# EAGLE design Display_Block (EAGLE 5.06)
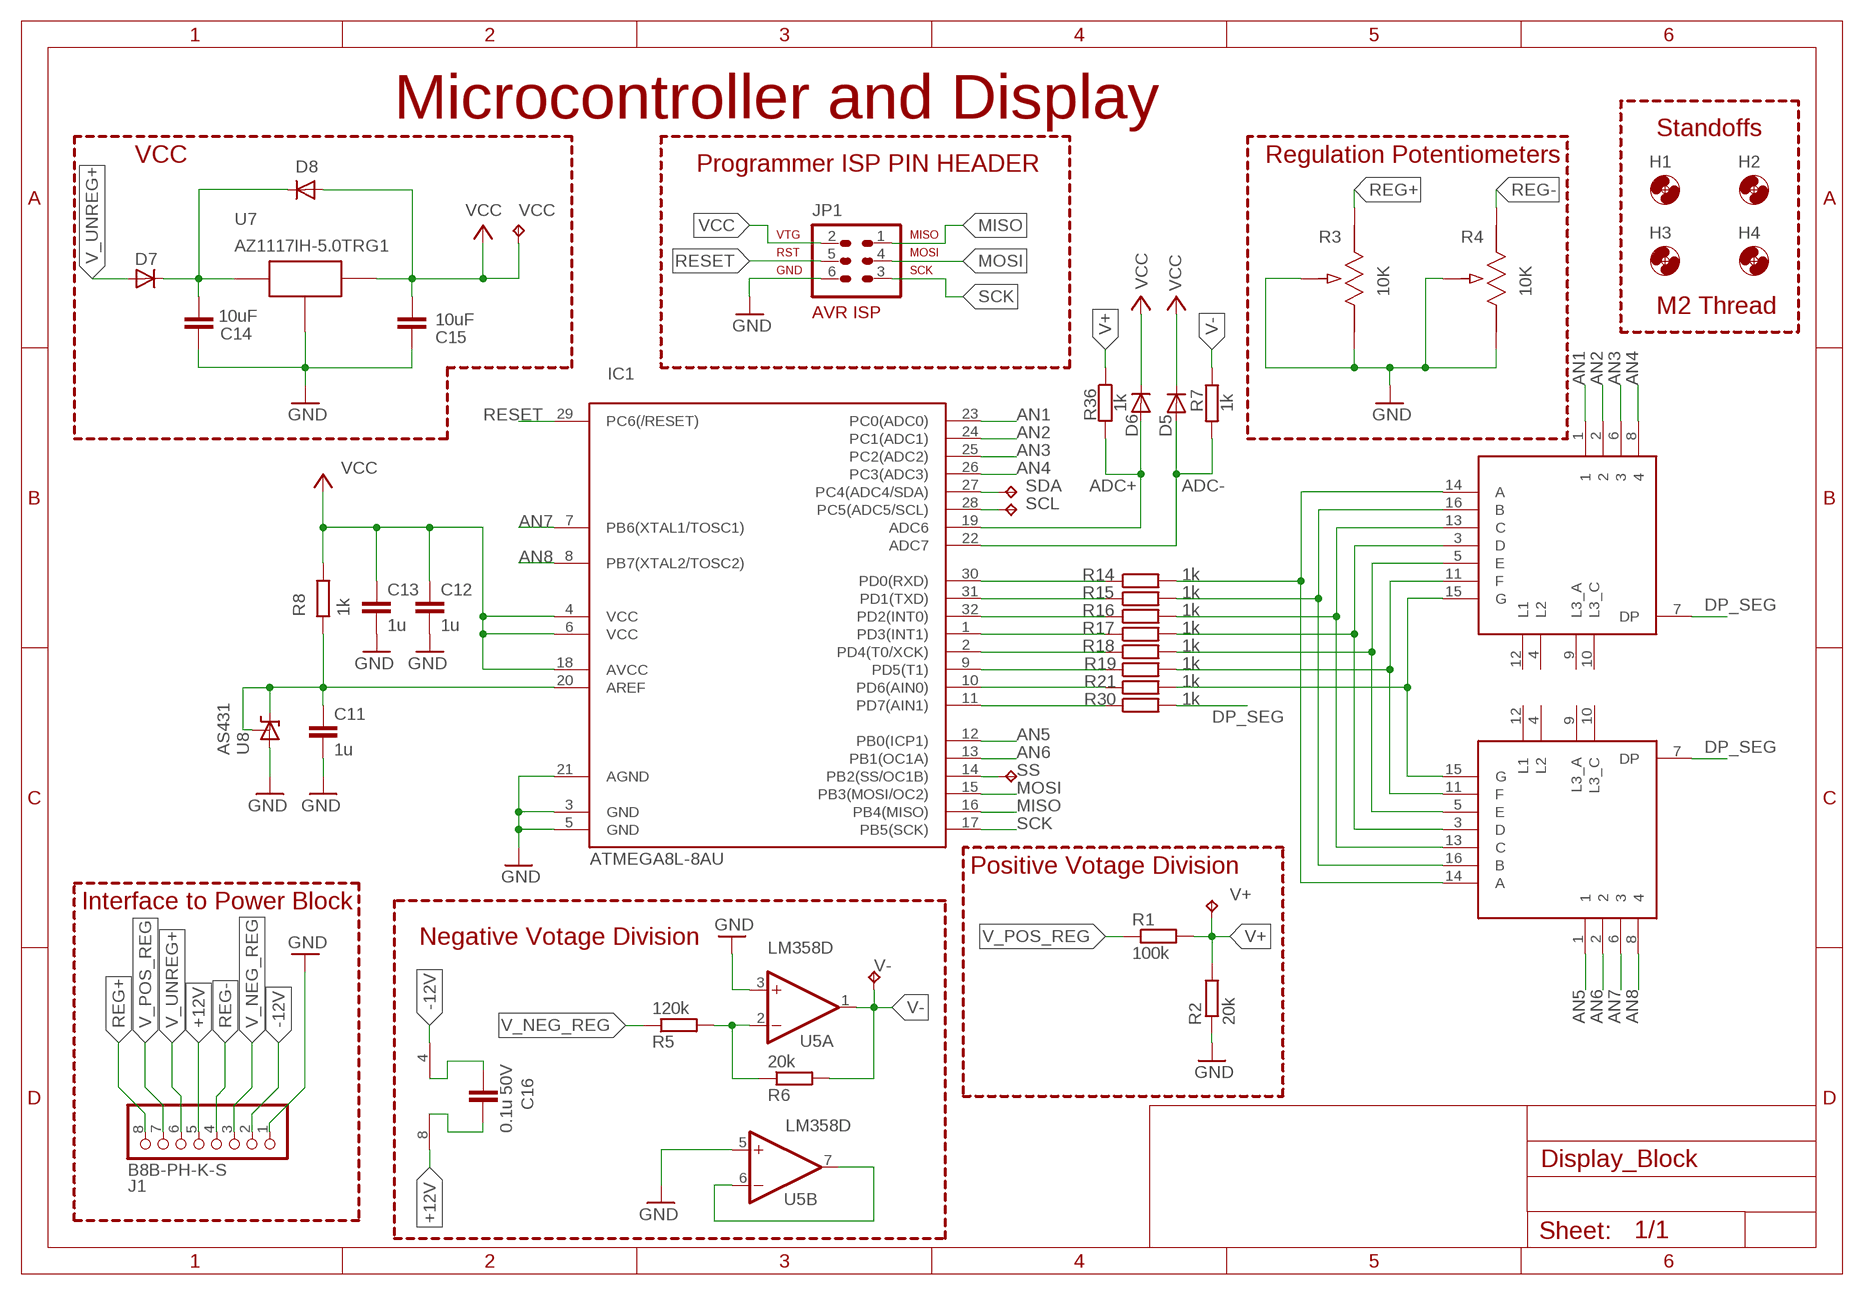
[diagram p0: schematic, sheet 1]

## Parts
C11  1u  C-EUC0603  [C0603]
C12  1u  C-EUC0603  [C0603]
C13  1u  C-EUC0603  [C0603]
C14  10uF  C-EUC0603  [C0603]
C15  10uF  C-EUC0603  [C0603]
C16  0.1u 50V  C-EU025-024X044  [C025-024X044]
D5  1N4148DO35-7  [DO35-7]
D6  1N4148DO35-7  [DO35-7]
D7  1N4004  [DO41-10]
D8  1N4004  [DO41-10]
H1  MOUNT-PAD-ROUND2.2  MOUNT-HOLE2.2  [2,2]
H2  MOUNT-PAD-ROUND2.2  MOUNT-HOLE2.2  [2,2]
H3  MOUNT-PAD-ROUND2.2  MOUNT-HOLE2.2  [2,2]
H4  MOUNT-PAD-ROUND2.2  MOUNT-HOLE2.2  [2,2]
IC1  ATMEGA8L-8AU  ATMEGA8-AU  [TQFP32-08]
J1  B8B-PH-K-S  [B8B-PH-K-S]
JP1  AVR-ISP-6  [AVR-ISP-6]
R1  100k  R-EU_R0603  [R0603]
R2  20k  R-EU_R0603  [R0603]
R3  10K  P120PK-Y25BR10K  [POT_P120PK-X25_TTE]
R4  10K  P120PK-Y25BR10K  [POT_P120PK-X25_TTE]
R5  120k  R-EU_R0603  [R0603]
R6  20k  R-EU_R0603  [R0603]
R7  1k  R-EU_R0603  [R0603]
R8  1k  R-EU_R0603  [R0603]
R14  1k  R-EU_R0603  [R0603]
R15  1k  R-EU_R0603  [R0603]
R16  1k  R-EU_R0603  [R0603]
R17  1k  R-EU_R0603  [R0603]
R18  1k  R-EU_R0603  [R0603]
R19  1k  R-EU_R0603  [R0603]
R21  1k  R-EU_R0603  [R0603]
R30  1k  R-EU_R0603  [R0603]
R36  1k  R-EU_R0603  [R0603]
SCL  TPTP20SQ  [TP20SQ]
SDA  TPTP20SQ  [TP20SQ]
SEG1  TDCG1050M-ND  [TDCX10X0M]
SEG2  TDCR1050M-ND  [TDCX10X0M]
SS  TPTP20SQ  [TP20SQ]
U5  LM358D  [SO08]
U7  AZ1117IH-5.0TRG1  [SOT223]
U8  AS431  AS431ANTR-G1  [SOT23]
V+  TPTP20SQ  [TP20SQ]
V-  TPTP20SQ  [TP20SQ]
VCC  TPTP20SQ  [TP20SQ]

## Nets
+12V: C16.2 J1.5 U5.8(P:V+)
-12V: C16.1 J1.2 U5.4(P:V-)
ADC+: D6.A IC1.19(ADC6) R36.2
ADC-: D5.A IC1.22(ADC7) R7.2
AN1: IC1.23(PC0(ADC0)) SEG1.1
AN2: IC1.24(PC1(ADC1)) SEG1.2
AN3: IC1.25(PC2(ADC2)) SEG1.6
AN4: IC1.26(PC3(ADC3)) SEG1.8
AN5: IC1.12(PB0(ICP1)) SEG2.1
AN6: IC1.13(PB1(OC1A)) SEG2.2
AN7: IC1.7(PB6(XTAL1/TOSC1)) SEG2.6
AN8: IC1.8(PB7(XTAL2/TOSC2)) SEG2.8
AREF: C11.1 IC1.20(AREF) R8.1 U8.1(REF) U8.2(C)
DP_SEG: R30.2 SEG1.7(DP) SEG2.7(DP)
GND: C11.2 C12.2 C13.2 C14.1 C15.1 IC1.3(GND) IC1.5(GND) IC1.21(AGND) J1.1 JP1.6 R2.1 R3.1 R3.2 R4.1 R4.2 U5.3(A:+IN) U5.5(B:+IN) U7.2 U8.3(A)
MISO: IC1.16(PB4(MISO)) JP1.1
MOSI: IC1.15(PB3(MOSI/OC2)) JP1.4
N$5: U5.6(B:-IN) U5.7(B:OUT)
N$16: R5.2 R6.1 U5.2(A:-IN)
N$19: C14.2 D7.C D8.C U7.1
PD0: IC1.30(PD0(RXD)) R14.1
PD1: IC1.31(PD1(TXD)) R15.1
PD2: IC1.32(PD2(INT0)) R16.1
PD3: IC1.1(PD3(INT1)) R17.1
PD4: IC1.2(PD4(T0/XCK)) R18.1
PD5: IC1.9(PD5(T1)) R19.1
PD6: IC1.10(PD6(AIN0)) R21.1
PD7: IC1.11(PD7(AIN1)) R30.1
REG+: J1.8 R3.3
REG-: J1.4 R4.3
RESET: IC1.29(PC6(/RESET)) JP1.5
SCK: IC1.17(PB5(SCK)) JP1.3
SCL: IC1.28(PC5(ADC5/SCL)) SCL.TP
SDA: IC1.27(PC4(ADC4/SDA)) SDA.TP
SEG_A: R14.2 SEG1.14(A) SEG2.14(A)
SEG_B: R15.2 SEG1.16(B) SEG2.16(B)
SEG_C: R16.2 SEG1.13(C) SEG2.13(C)
SEG_D: R17.2 SEG1.3(D) SEG2.3(D)
SEG_E: R18.2 SEG1.5(E) SEG2.5(E)
SEG_F: R19.2 SEG1.11(F) SEG2.11(F)
SEG_G: R21.2 SEG1.15(G) SEG2.15(G)
SS: IC1.14(PB2(SS/OC1B)) SS.TP
V+: R1.2 R2.2 R36.1 V+.TP
V-: R6.2 R7.1 U5.1(A:OUT) V-.TP
V_NEG_REG: J1.3 R5.1
V_POS_REG: J1.7 R1.1
V_UNREG+: D7.A J1.6
VCC: C12.1 C13.1 C15.2 D5.C D6.C D8.A IC1.4(VCC) IC1.6(VCC) IC1.18(AVCC) JP1.2 R8.2 U7.3 VCC.TP
Unconnected: SEG1.4(L2) SEG1.9(L3_A) SEG1.10(L3_C) SEG1.12(L1) SEG2.4(L2) SEG2.9(L3_A) SEG2.10(L3_C) SEG2.12(L1)

## Notes on the sheet
- Microcontroller and Display
- Standoffs
- VCC | Regulation Potentiometers
- Programmer ISP PIN HEADER
- M2 Thread
- Positive Votage Division
- Interface to Power Block
- Negative Votage Division

## Library data of the parts
C11-C16 = rcl:C-EU: CAPACITOR, European symbol
D5 D6 = diode:1N4148: DIODE high speed (Philips)
D7 D8 = diode:1N4004: DIODE general purpose rectifier, 1 A
H1-H4 = holes:MOUNT-HOLE: MOUNTING HOLE with drill center marker
IC1 = atmega8:ATMEGA8
J1 = VladimirG:B8B-PH-K-S: CONN HEADER VERT 8POS 2MM
JP1 = avr-4:AVR-ISP-6: AVR ISP-6 Serial Programming Header
R1 R2 R5 R6 R8 = rcl:R-EU_: RESISTOR, European symbol
R3 R4 = VladimirG:P120PK-Y25BR10K: POT 10K OHM 1/20W PLASTIC LINEAR; COPYRIGHT: Copyright (C) 2025 Ultra Librarian. All rights reserved.; MANUFACTURER_NAME: TT Electronics; MANUFACTURER_PART_NUMBER: P120PK-Y25BR10K; VALUE: 10k
R7 R14-R19 R21 R30 R36 = resistor:R-EU_: RESISTOR, European symbol
SCL SDA SS V+ V- VCC = testpad:TP: Test pad
SEG1 = VladimirG:TDCG1050M-ND
SEG2 = VladimirG:TDCR1050M-ND
U5 = linear:LM358: OP AMP also LM158; LM258; LM2904 Source: http://cache.national.com/ds/LM/LM158.pdf
U7 = VladimirG:AZ1117IH-5.0TRG1: Linear Voltage Regulator IC Positive Fixed 1 Output 1A SOT-223-3
U8 = VladimirG:AS431ANTR-G1: Shunt Voltage Reference IC Adjustable 2.5V 36 VV ±0.5% 100 mA SOT-23-3

## Board
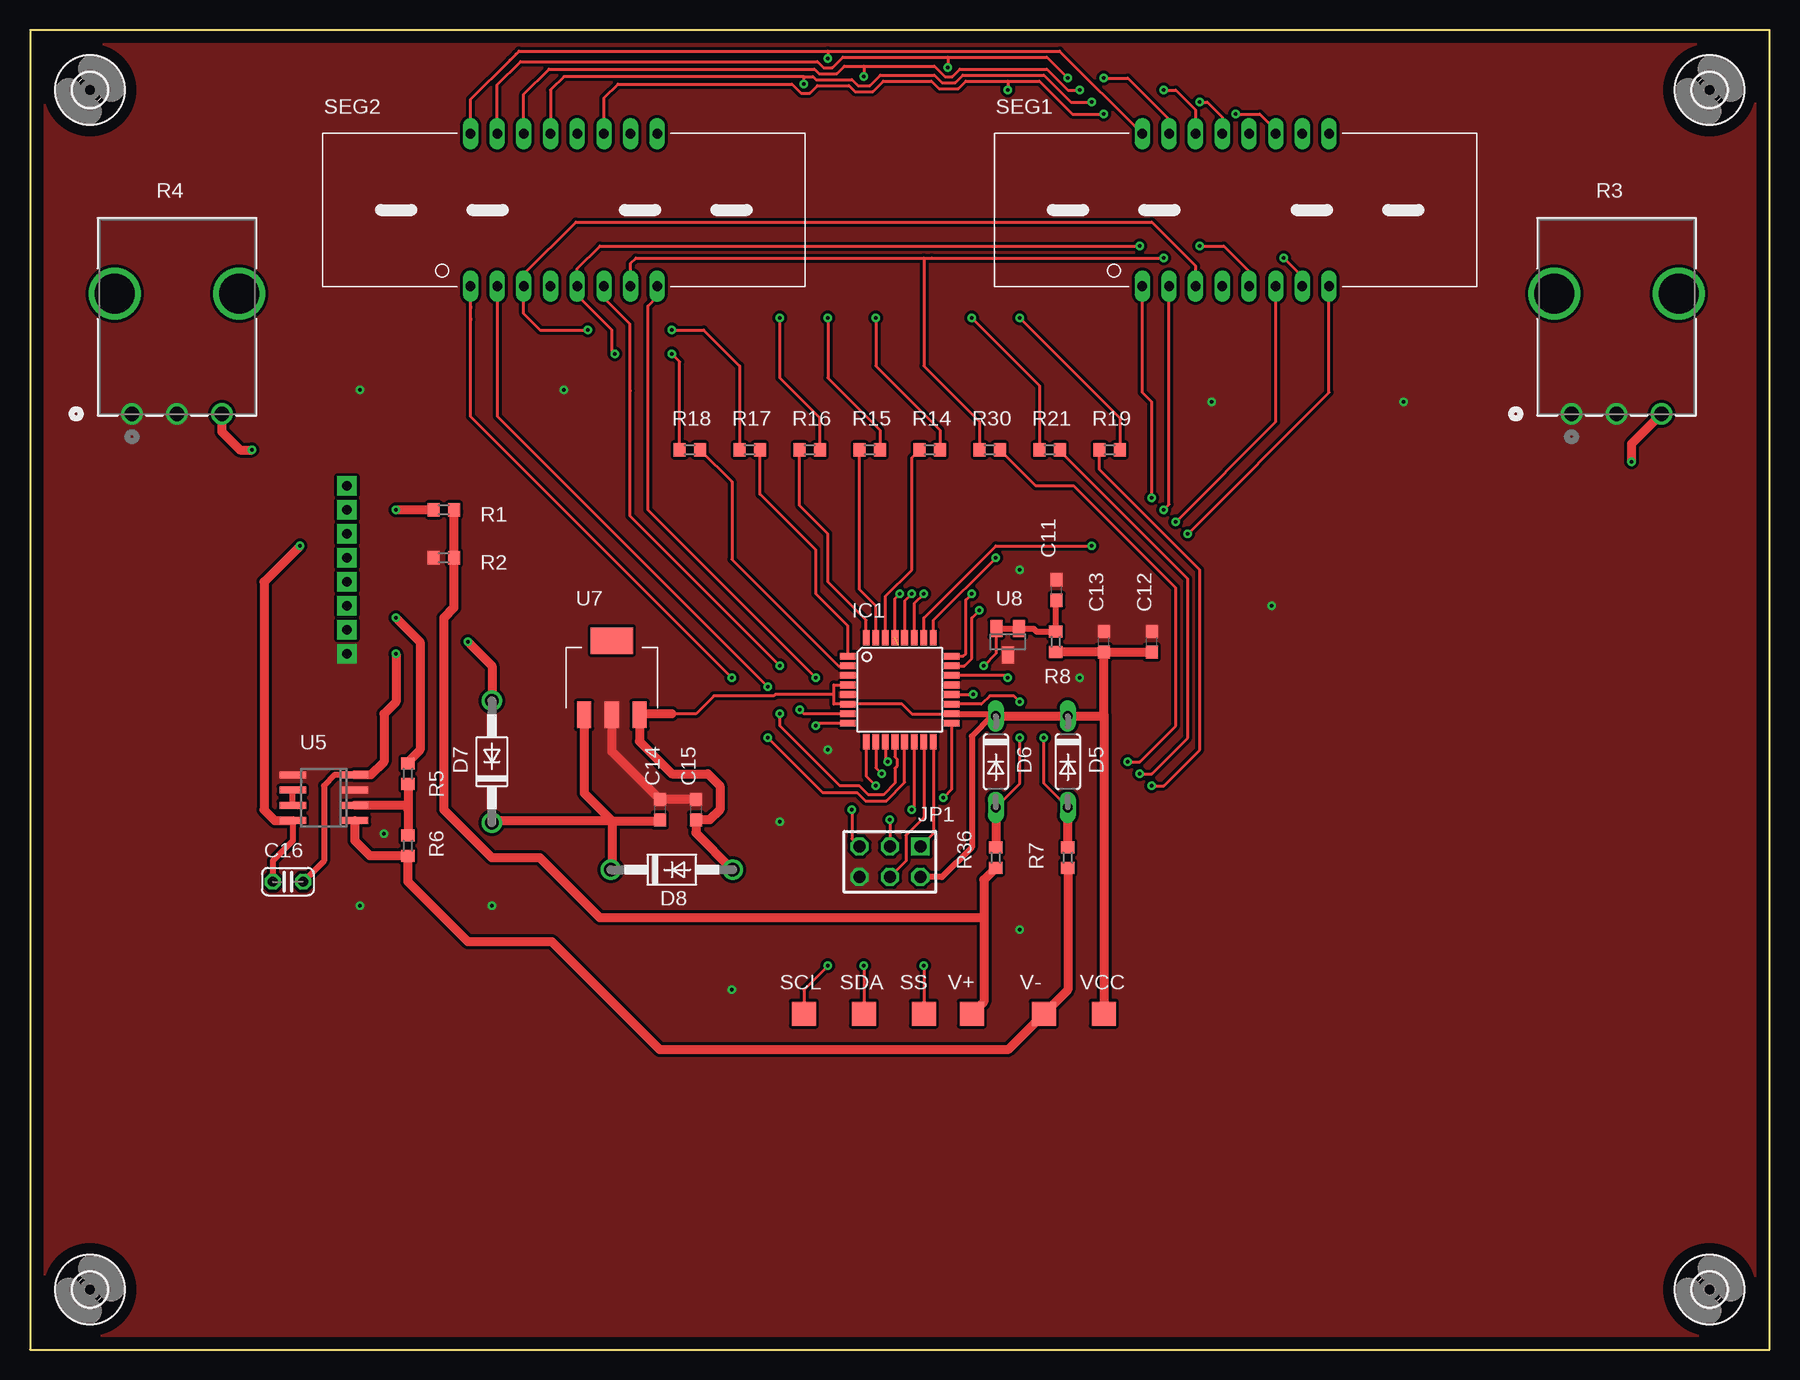
[diagram p1: board, top side]
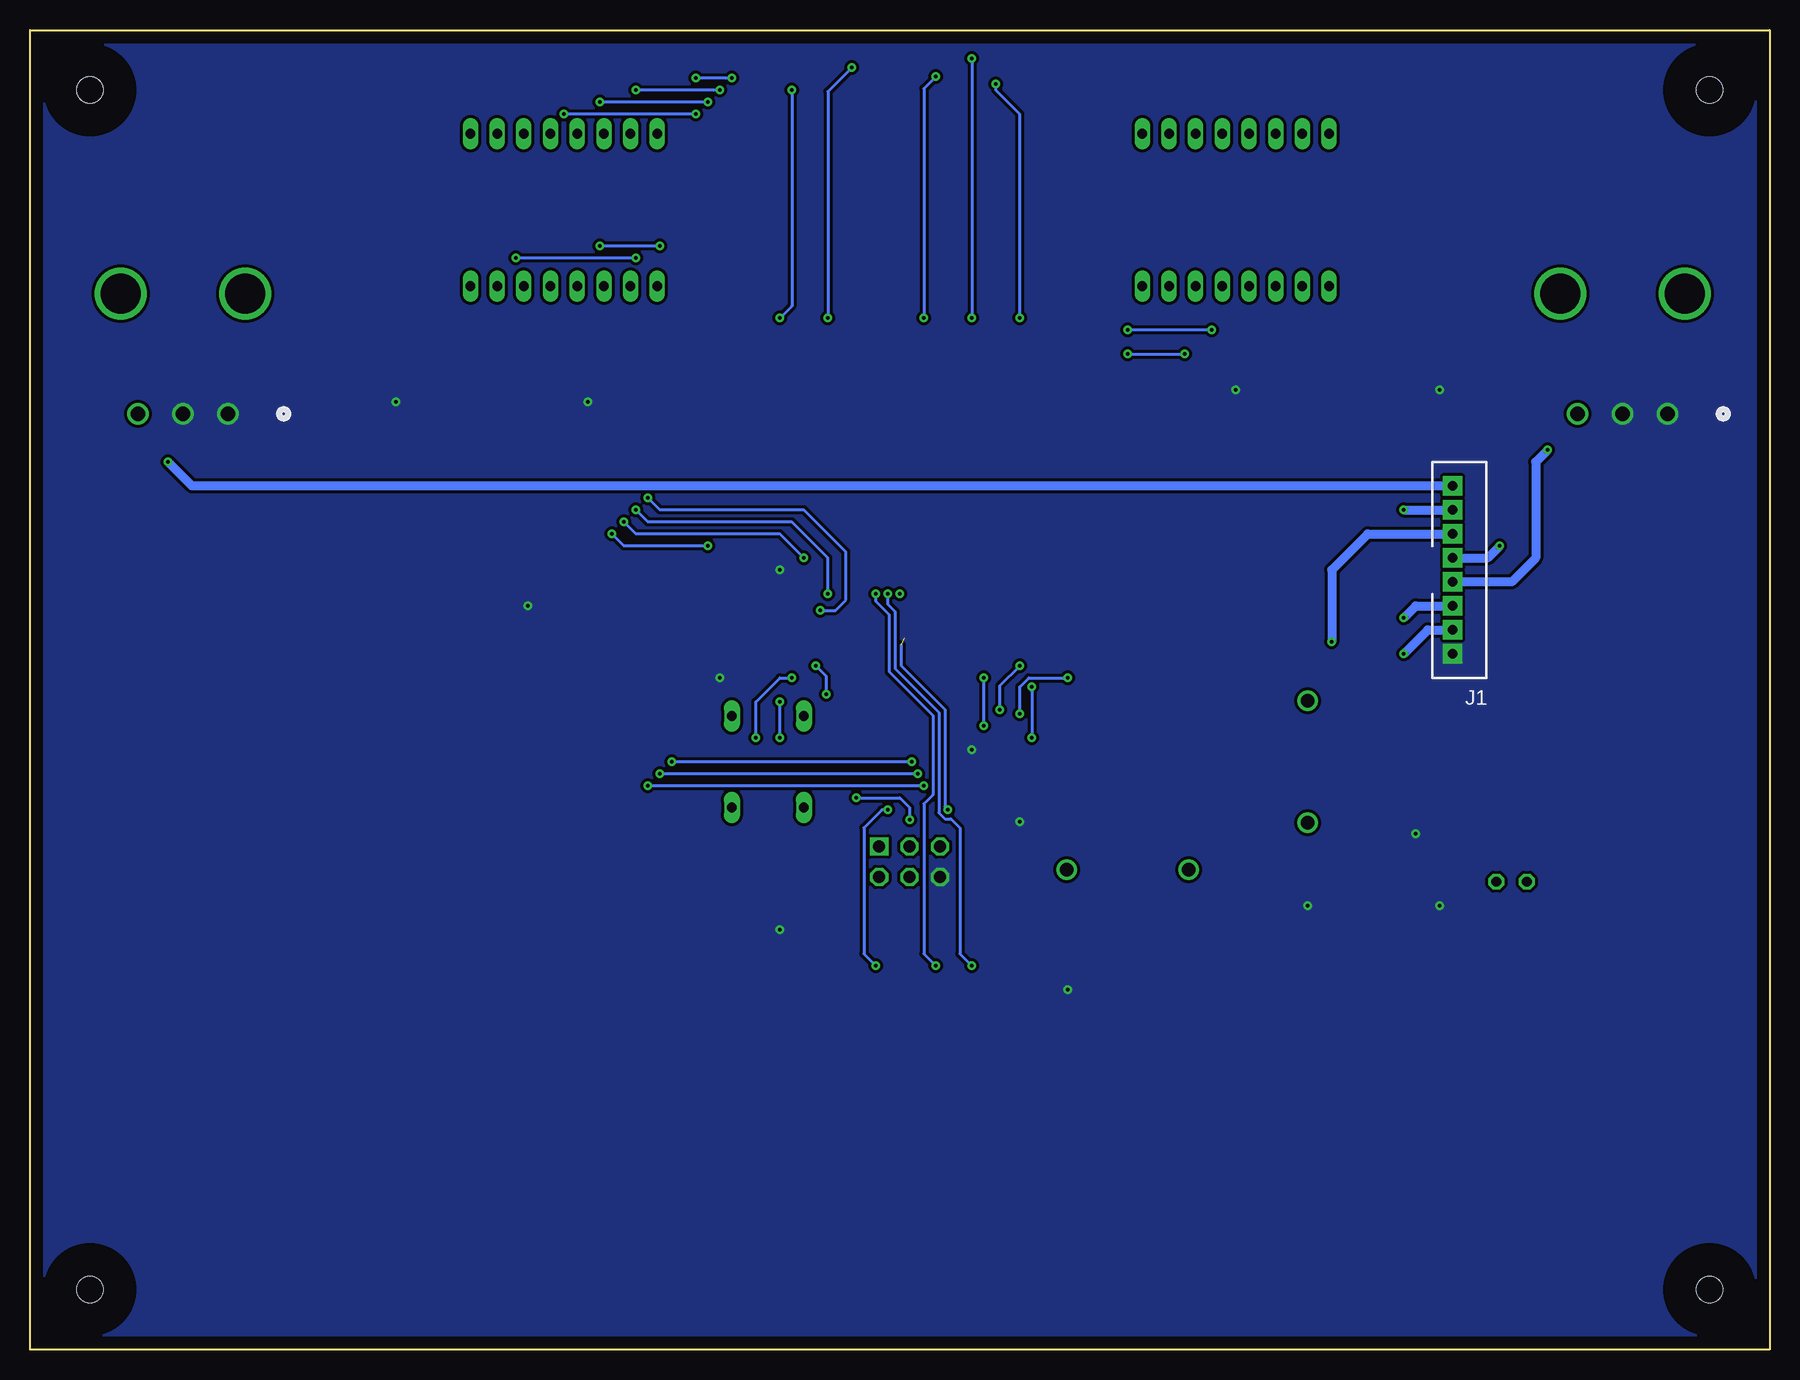
[diagram p2: board, bottom side, seen from below]

Size 145 x 110 mm. Coordinates in mm from the lower left corner, seen from the top.
Outline: 0,0 145,0 145,110 0,110 0,0
Copper layers (1*16): Top 0.035mm / dielectric 1.5mm / Bottom 0.035mm
Design rules "default *": minimum track width 8mil, minimum drill 12mil, track to track 8mil, track to pad 8mil, pad to pad 8mil, via to via 8mil, smd to smd 8mil, copper to edge 40mil, drill to drill 8mil, minimum pad ring 10mil, minimum via ring 8mil, stop-mask expansion 4mil, vias tented up to drill 999mil, thermal gap 10mil

### Footprints (pad centres in the part's own frame; a part is rotated, then mirrored left to right if it is on the bottom)
C0603 = smd 1.1 x 1: 1 -0.85,0; 2 0.85,0
C025-024X044 = drill 0.813 octagon: 1 -1.27,0; 2 1.27,0
DO35-7 = drill 0.813 long: A 3.81,0; C -3.81,0
DO41-10 = drill 1.118 round: A 5.08,0; C -5.08,0
2,2 = hole 2.2: 0,0
TQFP32-08 = smd 1.27 x 0.559: 1 -4.325,2.8; 2 -4.325,2; 3 -4.325,1.2; 4 -4.325,0.4; 5 -4.325,-0.4; 6 -4.325,-1.2; 7 -4.325,-2; 8 -4.325,-2.8; 17 4.325,-2.8; 18 4.325,-2; 19 4.325,-1.2; 20 4.325,-0.4; 21 4.325,0.4; 22 4.325,1.2; 23 4.325,2; 24 4.325,2.8 | smd 0.559 x 1.27: 9 -2.8,-4.325; 10 -2,-4.325; 11 -1.2,-4.325; 12 -0.4,-4.325; 13 0.4,-4.325; 14 1.2,-4.325; 15 2,-4.325; 16 2.8,-4.325; 25 2.8,4.325; 26 2,4.325; 27 1.2,4.325; 28 0.4,4.325; 29 -0.4,4.325; 30 -1.2,4.325; 31 -2,4.325; 32 -2.8,4.325
B8B-PH-K-S = drill 0.8 pad 1.6 square: 1 -0.085,7; 2 -0.085,5; 3 -0.085,3; 4 -0.085,1; 5 -0.085,-1; 6 -0.085,-3; 7 -0.085,-5; 8 -0.085,-7
AVR-ISP-6 = drill 1.016 square: 1 -2.54,-1.27 | drill 1.016 octagon: 2 -2.54,1.27; 3 0,-1.27; 4 0,1.27; 5 2.54,-1.27; 6 2.54,1.27
R0603 = smd 1 x 1.1: 1 -0.85,0; 2 0.85,0
POT_P120PK-X25_TTE = drill 1.194 pad 1.702 round: 1 0,0; 2 3.759,0; 3 7.493,0 | drill 3.327 pad 3.327 round: 4 -1.448,10.008; 5 8.941,10.008
TP20SQ = smd 2 x 2: TP 0,0
TDCX10X0M = drill 0.8 long: 1 -7.779,-6.35; 2 -5.556,-6.35; 3 -3.334,-6.35; 4 -1.111,-6.35; 5 1.111,-6.35; 6 3.334,-6.35; 7 5.556,-6.35; 8 7.779,-6.35; 9 7.779,6.35; 10 5.556,6.35; 11 3.334,6.35; 12 1.111,6.35; 13 -1.111,6.35; 14 -3.334,6.35; 15 -5.556,6.35; 16 -7.779,6.35
SO08 = smd 0.6 x 2.2: 1 -1.905,-2.6; 2 -0.635,-2.6; 3 0.635,-2.6; 4 1.905,-2.6; 5 1.905,2.6; 6 0.635,2.6; 7 -0.635,2.6; 8 -1.905,2.6
SOT223 = smd 1.194 x 2.21: 1 -2.311,-3.099; 2 0,-3.099; 3 2.311,-3.099 | smd 3.505 x 2.21: VOUT 0,3.099
SOT23 = smd 1 x 1.4: 1 -0.95,-1.1; 2 0.95,-1.1; 3 0,1.1

### Placement (x,y rotation side)
C11  85.57,63.31 90 top
C12  93.5,59 90 top
C13  89.5,59 90 top
C14  52.5,45 270 top
C15  55.5,45 270 top
C16  21.5,39 180 top
D5  86.5,49 270 top
D6  80.5,49 270 top
D7  38.5,49 90 top
D8  53.5,40 0 top
H1  5,5 0 top
H2  5,105 0 top
H3  140,5 0 top
H4  140,105 0 top
IC1  72.5,55 0 top
J1  26.5,65 180 bottom
JP1  71.68,40.66 180 top
R1  34.5,70 0 top
R2  34.5,66 0 top
R3  128.5,78 0 top
R4  8.5,78 0 top
R5  31.5,48 270 top
R6  31.5,42 270 top
R7  86.5,41 90 top
R8  85.5,59 270 top
R14  75,75 0 top
R15  70,75 0 top
R16  65,75 0 top
R17  60,75 180 top
R18  55,75 180 top
R19  90,75 0 top
R21  85,75 180 top
R30  80,75 180 top
R36  80.5,41 90 top
SCL  64.5,28 0 top
SDA  69.5,28 0 top
SEG1  100.5,95 0 top
SEG2  44.5,95 0 top
SS  74.5,28 0 top
U5  24.5,46 90 top
U7  48.5,56 0 top
U8  81.5,59 180 top
V+  78.5,28 0 top
V-  84.5,28 0 top
VCC  89.5,28 0 top

### Tracks (layer width: path | path; a pad name or v marks a point on that pad's centre or on a via)
+12V  (via drill 0.3 pad 0.71)
  Top 0.5: C16.2 20.23,40.73 21.9,42.4 U5.8
  Top 0.75: U5.8 20.41,44.09 19.5,45 19.5,64 v22.5,67
  Bottom 0.75: J1.5 23.5,66 v22.5,67
-12V  (via drill 0.3 pad 0.71)
  Top 0.5: U5.4 25.41,47.91 24.5,47 24.5,40.73 C16.1
  Top 0.75: U5.4 28.41,47.91 29.5,49 29.5,53 30.5,54 v30.5,58
  Bottom 0.75: v30.5,58 28.5,60 J1.2
ADC+  (via drill 0.3 pad 0.71)
  Top 0.25: IC1.19 79.3,53.8 80,54.5 82,54.5 v82.5,54 | v82.5,51 82.5,47.19 D6.A
  Top 0.75: D6.A R36.2
  Bottom 0.25: v82.5,51 v82.5,54
ADC-  (via drill 0.3 pad 0.71)
  Top 0.25: v84.5,51 84.5,47.19 D5.A | IC1.22 81.3,56.2 v81.5,56
  Top 0.75: R7.2 D5.A
  Bottom 0.25: v81.5,56 82.5,56 84.5,54 v84.5,51
AN1  (via drill 0.3 pad 0.71)
  Top 0.25: IC1.23 77.88,57 78.5,57.62 78.5,61 v79.12,61.62 | SEG1.1 92.72,79.78 93.5,79 v93.5,71
  Bottom 0.25: v93.5,71 92.5,70 80.5,70 77,66.5 77,62.5 77.88,61.62 v79.12,61.62
AN2  (via drill 0.3 pad 0.71)
  Top 0.25: IC1.24 77.8,57.8 78,58 78,62.5 v78.5,63 | SEG1.2 94.94,70.44 v94.5,70
  Bottom 0.25: v78.5,63 78.5,66 81.5,69 93.5,69 v94.5,70
AN3  (via drill 0.3 pad 0.71)
  Top 0.25: v80.5,66 75.3,60.8 IC1.25 | v95.5,69 103.83,77.33 SEG1.6
  Bottom 0.25: v80.5,66 82.5,68 94.5,68 v95.5,69
AN4  (via drill 0.3 pad 0.71)
  Top 0.25: IC1.26 74.5,61 80.5,67 v88.5,67 | v96.5,68 108.28,79.78 SEG1.8
  Bottom 0.25: v88.5,67 95.5,67 v96.5,68
AN5  (via drill 0.3 pad 0.71)
  Top 0.25: 36.72,87 SEG2.1 | 36.72,87 36.72,86.78 | 36.72,86 36.72,87 | 36.72,86 36.72,85.78 | v62.5,53 62.5,52 67.5,47 69.12,47 69.88,46.25 71.12,46.25 72.1,47.23 72.1,48.48 72.25,48.62 72.25,49.25 72.1,49.4 IC1.12 | v58.5,56 36.72,77.78 36.72,86
  Bottom 0.25: v58.5,56 61.75,56 62.5,55.25 v62.5,53
AN6  (via drill 0.3 pad 0.71)
  Top 0.25: IC1.13 72.9,47.27 71.38,45.75 69.62,45.75 68.94,46.44 66.06,46.44 v61.5,51 | v61.5,55.25 38.94,77.81 SEG2.2
  Bottom 0.25: v61.5,55.25 v61.5,51
AN7  (via drill 0.3 pad 0.71)
  Top 0.25: v64.16,53.34 64.5,53 IC1.7 | 50,80 50,85.5 47.83,87.67 SEG2.6 | 50,80 50,79.88 | v62.5,57 50,69.5 50,80
  Bottom 0.25: v64.16,53.34 64.16,55.34 v62.5,57
AN8  (via drill 0.3 pad 0.71)
  Top 0.25: v65.5,52 65.7,52.2 IC1.8 | SEG2.8 52.28,87.78 51.5,87 51.5,70 v65.5,56
  Bottom 0.25: v65.5,52 v65.5,56
AREF  (via drill 0.3 pad 0.71)
  Top 0.25: v78.62,54.62 78.6,54.6 IC1.20 | v79.5,57 80.55,58.05 U8.2 80.5,60.05 80.5,60
  Top 0.5: U8.2 U8.1 83.65,60.1 83.9,59.85 R8.1 85.5,62.46 C11.1
  Bottom 0.25: v78.62,54.62 78.62,56.12 v79.5,57
DP_SEG  (via drill 0.3 pad 0.71)
  Top 0.25: SEG2.7 50.06,90.56 50.5,91 74.5,91 | 74.5,91 v94.5,91 | v104.5,91 106.06,89.44 SEG1.7 | 74.5,91 75.15,91 | R30.2 79.15,77.35 74.5,82 74.5,91
  Bottom 0.25: v94.5,91 v104.5,91
GND  (via drill 0.3 pad 0.71)
  Top 0.75: C15.1 C14.1 48.5,49.85 U7.2
  other vias: 29.5,43 27.5,37 38.5,37 58.5,30 82.5,35 62.5,44 66.5,50 103.5,62 98.5,79 114.5,79 44.5,80 27.5,80 87.5,56 82.5,65
  pour Bottom (isolate 0.25, no thermals): 147.05,112 -2,112 -2,-2 147,-2
  pour Top (isolate 0.25, no thermals): -1,-1 -1,111 146,111 146,-1
MISO
  Top 0.25: IC1.16 75.3,43.01 JP1.1
MOSI
  Top 0.25: JP1.4 73,40.71 73,42.88 74.5,44.38 IC1.15
N$5
  Top 0.5: U5.7 U5.6
N$16
  Top 0.75: R5.2 31.5,45 | 31.5,45 R6.1 | U5.2 31.5,45.37 31.5,45
N$19
  Top 0.75: C14.2 52.5,44.08 48.5,44.08 | D8.C 48.5,40.08 48.5,44.08 | U7.1 46.19,46.39 48.5,44.08 | 48.5,44.08 38.66,44.08 D7.C
PD0
  Top 0.25: IC1.30 71.3,62.8 73.5,65 73.5,74.35 R14.1
PD1
  Top 0.25: R15.1 69.15,63.35 70.5,62 IC1.31
PD2
  Top 0.25: IC1.32 69.7,60.8 66.5,64 66.5,68 64.15,70.35 R16.1
PD3
  Top 0.25: R17.1 60.85,71.3 65.5,66.65 65.5,63 68.17,60.33 IC1.1
PD4
  Top 0.25: IC1.2 67.38,57 58.5,65.88 58.5,72.35 R18.1
PD5  (via drill 0.3 pad 0.71)
  Top 0.25: IC1.9 69.7,47.8 v70.5,47 | R19.1 89.15,73.35 97.5,65 97.5,50 94.5,47 v93.5,47
  Bottom 0.25: v70.5,47 v93.5,47
PD6  (via drill 0.3 pad 0.71)
  Top 0.25: IC1.10 70.5,48.5 v71,48 | R21.1 85.85,74.9 96.5,64.25 96.5,51 93.5,48 v92.5,48
  Bottom 0.25: v71,48 v92.5,48
PD7  (via drill 0.3 pad 0.71)
  Top 0.25: R30.1 83.85,72 87,72 95.5,63.5 95.5,52 92.5,49 v91.5,49 | v71.5,49 71.3,49.2 IC1.11
  Bottom 0.25: v71.5,49 v91.5,49
REG+  (via drill 0.3 pad 0.71)
  Top 0.75: v133.5,74 133.5,75.51 R3.3
  Bottom 0.75: J1.8 131.5,72 v133.5,74
REG-  (via drill 0.3 pad 0.71)
  Top 0.75: v18.5,75 17.5,75 15.99,76.51 R4.3
  Bottom 0.75: J1.4 21.5,64 19.5,66 19.5,74 v18.5,75
RESET  (via drill 0.3 pad 0.71)  (1 unrouted)
  Top 0.25: IC1.29 72.1,62.6 v72.5,63 | v68.5,45 68.5,42.57 JP1.5
  Bottom 0.25: v68.5,45 68.75,45.25 68.75,53.38 72.38,57 72.38,58.75
SCK  (via drill 0.3 pad 0.71)
  Top 0.25: v71.68,44.18 JP1.3 | IC1.17 76.83,46.7 v76.12,46
  Bottom 0.25: v71.68,44.18 71.68,45.18 72.5,46 v76.12,46
SCL  (via drill 0.3 pad 0.71)
  Top 0.25: IC1.28 72.9,62.4 v73.5,63 | SCL.TP 64.5,30 v66.5,32
  Bottom 0.25: v66.5,32 67.5,33 67.5,43.5 68.25,44.25 68.75,44.25 69.25,44.75 69.25,53.12 72.88,56.75 72.88,61.5 73.5,62.12 v73.5,63
SDA  (via drill 0.3 pad 0.71)
  Top 0.25: IC1.27 73.7,62.2 v74.5,63 | v69.5,32 SDA.TP
  Bottom 0.25: v69.5,32 70.5,33 70.5,45.5 69.75,46.25 69.75,52.88 70.19,53.31 | 70.19,53.31 73.38,56.5 73.38,61.25 74.5,62.38 v74.5,63 | 70.19,53.31 69.88,53
SEG_A  (via drill 0.3 pad 0.71)
  Top 0.25: SEG2.14 41.17,104.67 43.25,106.75 65.38,106.75 65.75,106.38 67.25,106.38 67.88,107 69.5,107 | v87.5,105 86.5,105 84.75,106.75 77.5,106.75 76.88,106.12 76.25,106.12 75.38,107 69.5,107 | v94.5,105 95.5,105 97.17,103.33 SEG1.14 | 69.5,107 v69.5,106.12 | R14.2 75.85,76.65 70.5,82 v70.5,86
  Bottom 0.25: v87.5,105 v94.5,105 | v70.5,86 70.5,105.12 v69.5,106.12
SEG_B  (via drill 0.3 pad 0.71)
  Top 0.25: SEG2.16 36.72,104.22 40,107.5 | 40,107.5 40.5,108 | 66.5,108.25 v66.5,107.62 | 66.5,108.25 85.82,108.25 SEG1.16 | 66.5,108.25 40.75,108.25 40,107.5 | R15.2 70.85,76.65 66.5,81 v66.5,86
  Bottom 0.25: v66.5,107.62 v66.5,86
SEG_C  (via drill 0.3 pad 0.71)
  Top 0.25: SEG2.13 43.39,105.01 44.5,106.12 64.5,106.12 | 64.5,106.12 65.25,106.12 65.5,105.88 68.5,105.88 69,105.38 70,105.38 70.88,106.25 75.38,106.25 76,105.62 77.12,105.62 77.75,106.25 84.5,106.25 86.75,104 v88.5,104 | v97.5,104 98.12,104 99.39,102.74 SEG1.13 | v64.5,105.5 64.5,106.12 | R16.2 65.85,77.65 62.5,81 v62.5,86
  Bottom 0.25: v62.5,86 62.5,103 64.5,105 v64.5,105.5 | v88.5,104 v97.5,104
SEG_D  (via drill 0.3 pad 0.71)
  Top 0.25: 96,91.5 97.17,90.33 SEG1.3 | 96,91.5 95.5,92 | 96,91.5 93.5,94 45.5,94 41.17,89.67 SEG2.3 41.17,86.33 42.5,85 v46.5,85 | v53.5,85 56.15,85 59.15,82 R17.2
  Bottom 0.25: v46.5,85 v53.5,85
SEG_E  (via drill 0.3 pad 0.71)
  Top 0.25: v92.5,92 47.5,92 45.61,90.11 SEG2.5 45.61,87.89 48.5,85 48.5,83.25 v48.75,83 | v97.5,92 99.5,92 101.5,90 101.5,88.76 SEG1.5 | v53.5,83 54.15,82.35 R18.2
  Bottom 0.25: v92.5,92 v97.5,92 | v53.5,83 v48.75,83
SEG_F  (via drill 0.3 pad 0.71)
  Top 0.25: SEG2.11 47.83,104.33 49,105.5 63.5,105.5 64.25,104.75 65,104.75 65.62,105.38 68.25,105.38 68.75,104.88 70.25,104.88 71.12,105.75 75.12,105.75 75.75,105.12 77.38,105.12 78,105.75 81.5,105.75 | v89.5,103 86.88,103 84.12,105.75 81.5,105.75 | v100.5,103 102.5,103 103.83,101.67 SEG1.11 | 81.5,105.75 v81.5,105 | R19.2 90.85,77.65 v82.5,86
  Bottom 0.25: v89.5,103 v100.5,103 | v81.5,105 81.5,87 v82.5,86
SEG_G  (via drill 0.3 pad 0.71)
  Top 0.25: SEG2.15 38.94,105.44 40.88,107.38 65.62,107.38 66.12,106.88 66.88,106.88 67.75,107.75 76.5,107.75 | v89.5,106 91.5,106 94.94,102.56 SEG1.15 | 76.5,107.75 84.75,107.75 v86.5,106 | 76.5,107.75 v76.5,106.88 | v78.5,86 84.15,80.35 R21.2
  Bottom 0.25: v86.5,106 v89.5,106 | v78.5,86 78.5,104.88 v76.5,106.88
SS  (via drill 0.3 pad 0.71)
  Top 0.25: IC1.14 73.7,45.2 v73.5,45 | 74.5,29 SS.TP v74.5,32
  Bottom 0.25: v73.5,45 74,45 75.5,43.5 75.5,33 v74.5,32
V+
  Top 0.75: R36.1 79.5,39.15 79.5,36 | 79.5,36 79.5,29 V+.TP | 79.5,36 47.5,36 42.5,41 38.5,41 34.5,45 34.5,61 35.35,61.85 R2.2 R1.2 35.5,69.85
V-
  Top 0.75: R7.1 86.5,30 V-.TP 81.5,25 52.5,25 43.5,34 36.5,34 31.5,39 R6.2 28.35,41.15 27.1,42.4 U5.1
V_NEG_REG  (via drill 0.3 pad 0.71)
  Top 0.75: R5.1 31.5,49 32.5,50 32.5,59 v30.5,61
  Bottom 0.75: v30.5,61 29.5,62 J1.3
V_POS_REG  (via drill 0.3 pad 0.71)
  Top 0.75: R1.1 v30.5,70
  Bottom 0.75: v30.5,70 J1.7
V_UNREG+  (via drill 0.3 pad 0.71)
  Top 0.75: D7.A 38.5,57 v36.5,59
  Bottom 0.75: v36.5,59 36.5,65 33.5,68 J1.6
VCC
  Top 0.25: 53.5,53 55.5,53 57,54.5 62,54.5 62.12,54.62 67,54.62 | IC1.18 73.5,53 72.7,53.8 IC1.6 67,53.8 67,54.62 | 67,54.62 67,55.4 IC1.4
  Top 0.5: IC1.18 80.31,53 D6.C 80.19,52.81 78.5,51.12 78.5,41.88 76.02,39.39 JP1.2
  Top 0.75: 53.5,53 50.91,53 U7.3 50.81,50.69 53.5,48 56.5,48 57.5,47 57.5,45 56.65,44.15 C15.2 55.5,43.08 D8.A | D6.C D5.C 89.5,52.81 89.5,53 | C13.1 C12.1 | 89.5,53 C13.1 | 89.5,53 VCC.TP | C13.1 R8.2